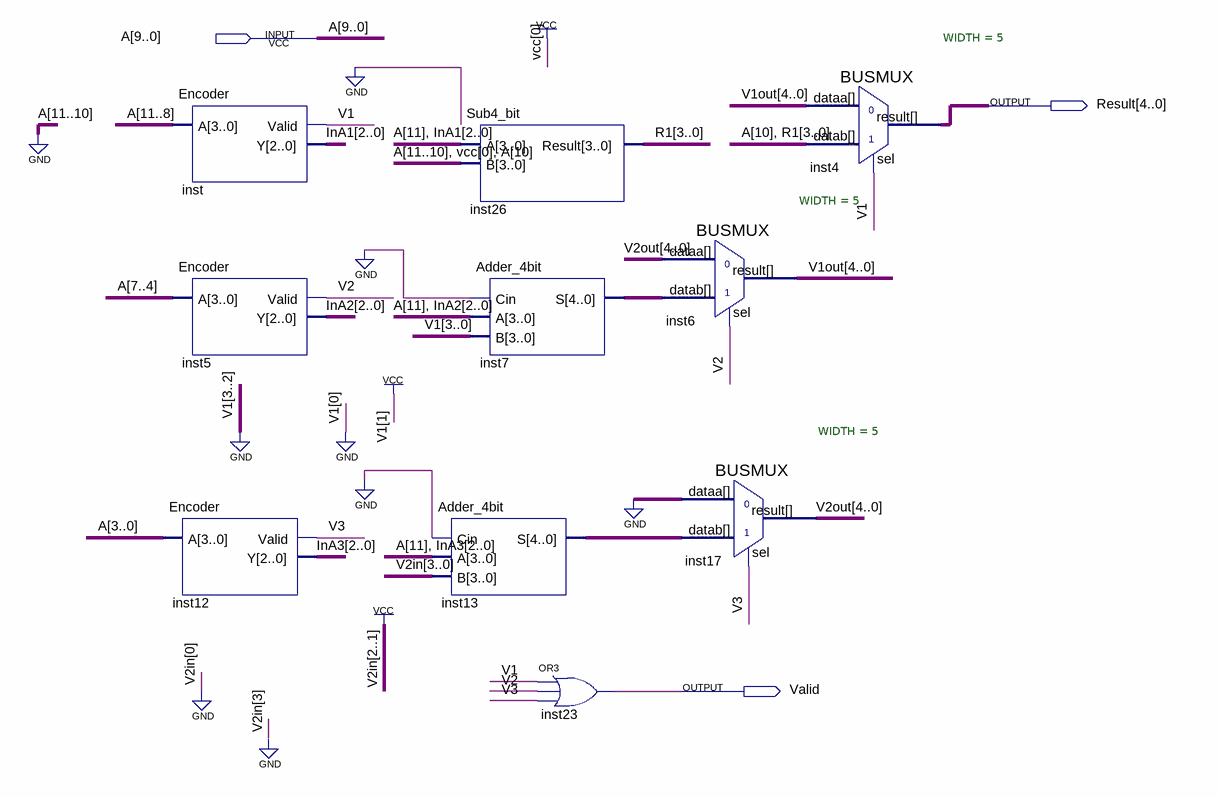
[diagram p0: schematic sheet]
// Quartus schematic Rounding_Logic.bdf as structural Verilog: 10 symbols, 3 pins
module Rounding_Logic (
  input  [9:0] A,
  output [4:0] Result,
  output Valid
);

  wire V1, V2, V3;
  wire [2:0] InA1, InA2, InA3;
  wire [3:0] R1;
  wire [3:3] V2in;
  wire [4:0] inst7_s, inst13_s, V1out, V2out;

  Encoder inst (.A({2'b00, A[9:8]}), .Valid(V1), .Y(InA1));
  Encoder inst5 (.A(A[7:4]), .Valid(V2), .Y(InA2));
  Encoder inst12 (.A(A[3:0]), .Valid(V3), .Y(InA3));
  Sub4_bit inst26 (.A({1'b0, InA1}), .B(4'b0010), .Result(R1));
  Adder_4bit inst13 (.Cin(1'b0), .A({1'b0, InA3}), .B({V2in[3], 3'b110}), .S(inst13_s));
  Adder_4bit inst7 (.Cin(1'b0), .A({1'b0, InA2}), .B(4'b0010), .S(inst7_s));
  or inst23 (Valid, V1, V2, V3);
  BUSMUX #(.WIDTH(5)) inst6 (.datab(inst7_s), .sel(V2), .dataa(V2out), .result(V1out));
  BUSMUX #(.WIDTH(5)) inst17 (.datab(inst13_s), .sel(V3), .dataa({5{1'b0}}), .result(V2out));
  BUSMUX #(.WIDTH(5)) inst4 (.datab({1'b0, R1}), .sel(V1), .dataa(V1out), .result(Result));
endmodule
